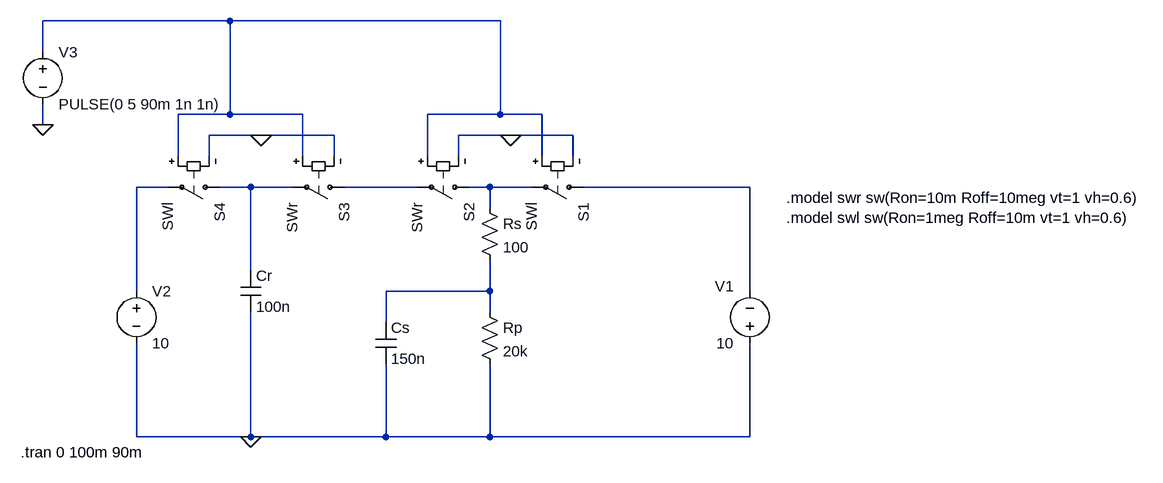
[diagram p0: schematic sys_pr_kl_ws0809.asc]
sys_pr_kl_ws0809.asc, the LTspice schematic file:
Version 4
SHEET 1 976 680
WIRE -512 -256 -800 -256
WIRE -96 -256 -512 -256
WIRE -800 -208 -800 -256
WIRE -512 -112 -512 -256
WIRE -512 -112 -592 -112
WIRE -400 -112 -512 -112
WIRE -96 -112 -96 -256
WIRE -96 -112 -208 -112
WIRE -32 -112 -96 -112
WIRE -800 -96 -800 -128
WIRE -464 -80 -544 -80
WIRE -352 -80 -464 -80
WIRE -80 -80 -160 -80
WIRE 16 -80 -80 -80
WIRE -592 -48 -592 -112
WIRE -544 -48 -544 -80
WIRE -400 -48 -400 -112
WIRE -352 -48 -352 -80
WIRE -208 -48 -208 -112
WIRE -160 -48 -160 -80
WIRE -32 -48 -32 -112
WIRE 16 -48 16 -80
WIRE -608 0 -656 0
WIRE -480 0 -528 0
WIRE -416 0 -480 0
WIRE -224 0 -336 0
WIRE -112 0 -144 0
WIRE -48 0 -112 0
WIRE 288 0 32 0
WIRE -112 32 -112 0
WIRE -480 128 -480 0
WIRE -656 160 -656 0
WIRE -112 160 -112 112
WIRE -112 160 -272 160
WIRE 288 160 288 0
WIRE -112 192 -112 160
WIRE -272 208 -272 160
WIRE -656 384 -656 240
WIRE -480 384 -480 192
WIRE -480 384 -656 384
WIRE -272 384 -272 272
WIRE -272 384 -480 384
WIRE -112 384 -112 272
WIRE -112 384 -272 384
WIRE 288 384 288 240
WIRE 288 384 -112 384
FLAG -800 -96 0
FLAG -480 384 0
FLAG -464 -80 0
FLAG -80 -80 0
SYMBOL res -128 16 R0
SYMATTR InstName Rs
SYMATTR Value 100
SYMBOL res -128 176 R0
SYMATTR InstName Rp
SYMATTR Value 20k
SYMBOL cap -288 208 R0
SYMATTR InstName Cs
SYMATTR Value 150n
SYMBOL voltage 288 256 R180
WINDOW 0 24 104 Left 0
WINDOW 3 24 16 Left 0
WINDOW 123 0 0 Left 0
WINDOW 39 0 0 Left 0
SYMATTR InstName V1
SYMATTR Value 10
SYMBOL voltage -656 144 R0
WINDOW 123 0 0 Left 0
WINDOW 39 0 0 Left 0
SYMATTR InstName V2
SYMATTR Value 10
SYMBOL cap -496 128 R0
SYMATTR InstName Cr
SYMATTR Value 100n
SYMBOL voltage -800 -224 R0
WINDOW 123 0 0 Left 0
WINDOW 39 0 0 Left 0
SYMATTR InstName V3
SYMATTR Value PULSE(0 5 90m 1n 1n)
SYMBOL sw 48 0 R90
SYMATTR InstName S1
SYMATTR Value SWl
SYMBOL sw -128 0 R90
SYMATTR InstName S2
SYMATTR Value SWr
SYMBOL sw -320 0 R90
SYMATTR InstName S3
SYMATTR Value SWr
SYMBOL sw -512 0 R90
SYMATTR InstName S4
SYMATTR Value SWl
TEXT 344 16 Left 0 !.model swr sw(Ron=10m Roff=10meg vt=1 vh=0.6)\n.model swl sw(Ron=1meg Roff=10m vt=1 vh=0.6)
TEXT -834 408 Left 0 !.tran 0 100m 90m

The netlist it stands for:
* sys_pr_kl_ws0809.asc
Rs N005 N007 100
Rp N007 0 20k
Cs N007 0 150n
V1 0 N006 10
V2 N002 0 10
Cr N003 0 100n
V3 N001 0 PULSE(0 5 90m 1n 1n)
S1 N006 N005 N001 0 SWl
S2 N005 N004 N001 0 SWr
S3 N004 N003 N001 0 SWr
S4 N003 N002 N001 0 SWl
.model swr sw(Ron=10m Roff=10meg vt=1 vh=0.6)
.model swl sw(Ron=1meg Roff=10m vt=1 vh=0.6)
.tran 0 100m 90m
.backanno
.end